# Altium schematic sheet microcontroller.SchDoc: Microcontroller
size A4; DrawnBy: Schuszter André
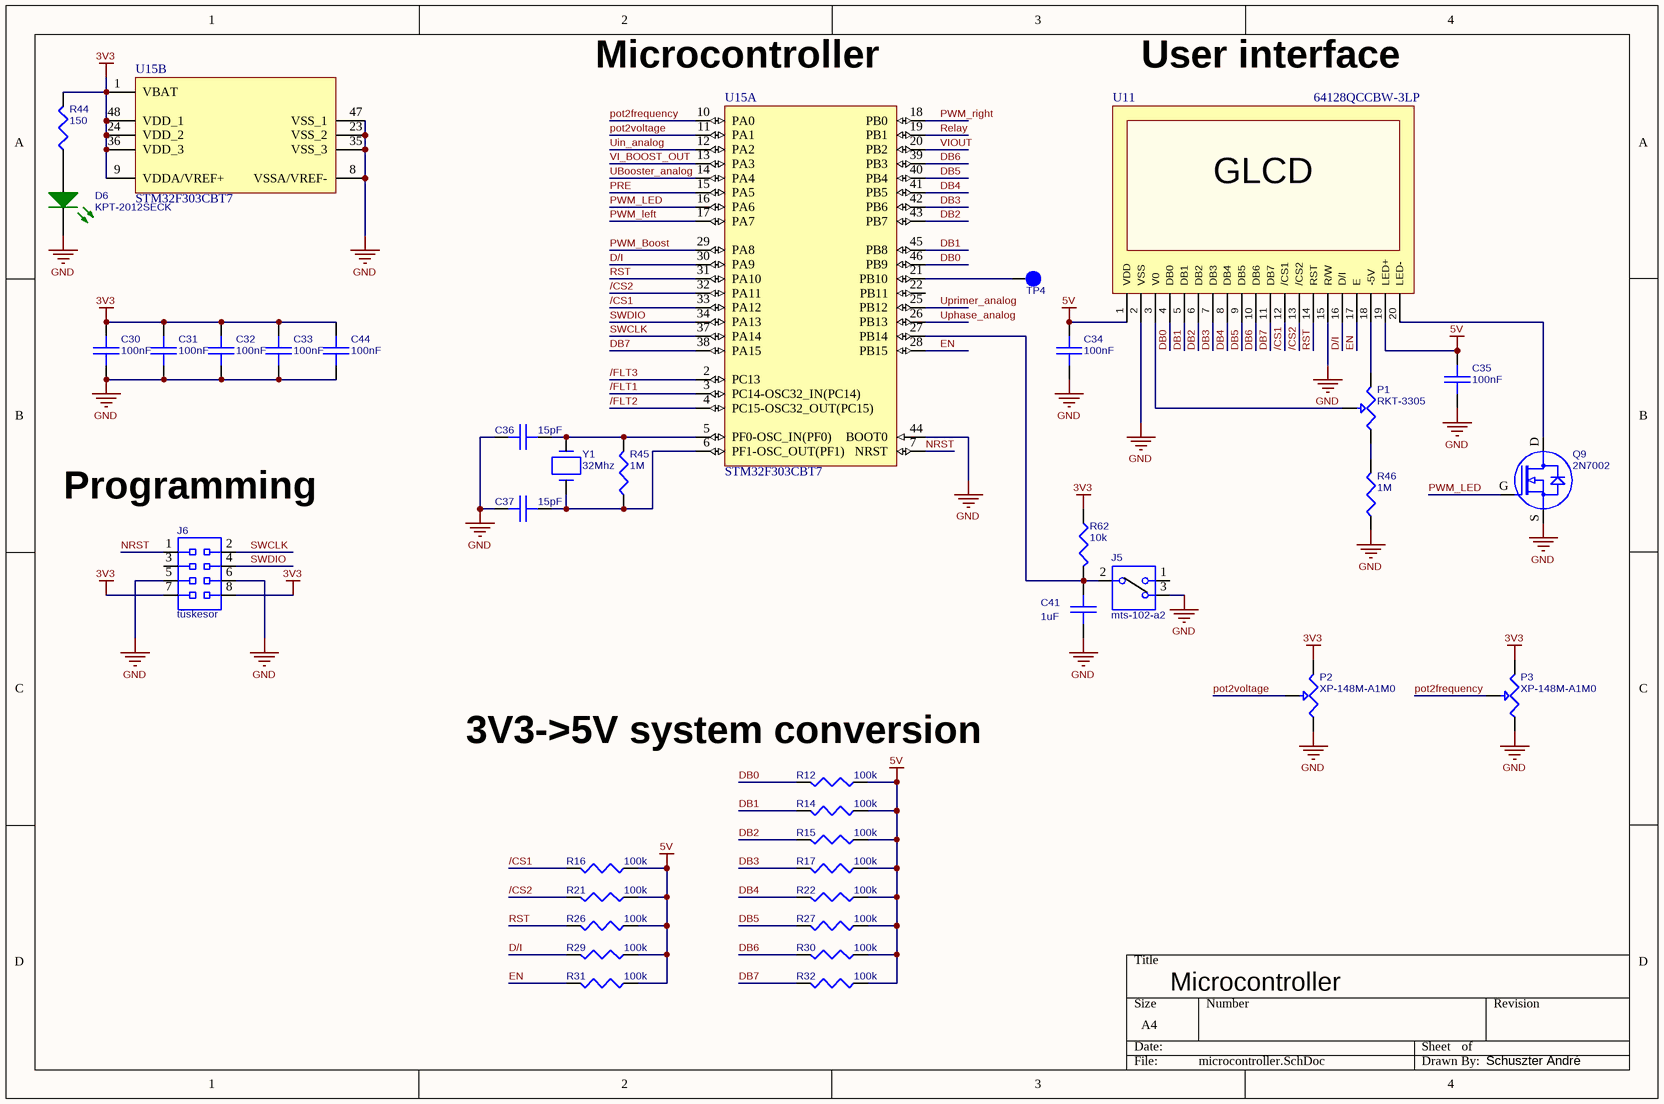
[diagram p0: microcontroller.SchDoc]

## Parts
C30  100nF  [CAPC2012X06N]
C31  100nF  [CAPC2012X06N]
C32  100nF  [CAPC2012X06N]
C33  100nF  [CAPC2012X06N]
C34  100nF  [CAPC2012X06N]
C35  100nF  [CAPC2012X06N]
C36  15pF  [CAPC2012X06N]
C37  15pF  [CAPC2012X06N]
C41  1uF  [CAPC2012X06N]
C44  100nF  [CAPC2012X06N]
D6  KPT-2012SECK  [LED2012X11N_GREEN]
J5  mts-102-a2  [TOGGLE]
J6  tüskesor  [PINH_M_2X4_100MIL_TH_HARWIN]
P1  RKT-3305  [TRIMMER]
P2  XP-148M-A1M0  [potmeter]
P3  XP-148M-A1M0  [potmeter]
Q9  2N7002  [SOT95P240X111_SGD-3N]
R12  100k  [RESC2012X06N]
R14  100k  [RESC2012X06N]
R15  100k  [RESC2012X06N]
R16  100k  [RESC2012X06N]
R17  100k  [RESC2012X06N]
R21  100k  [RESC2012X06N]
R22  100k  [RESC2012X06N]
R26  100k  [RESC2012X06N]
R27  100k  [RESC2012X06N]
R29  100k  [RESC2012X06N]
R30  100k  [RESC2012X06N]
R31  100k  [RESC2012X06N]
R32  100k  [RESC2012X06N]
R44  150  [RESC2012X06N]
R45  1M  [RESC2012X06N]
R46  1M  [RESC2012X06N]
R62  10k  [RESC2012X06N]
TP4  Comment  [TP200X150]  (value not drawn)  (no BOM)
U11  64128QCCBW-3LP  [LCD]
U15  STM32F303CBT7  [STM-LQFP48_N]  (parts A,B of 2)
Y1  32Mhz  [XTAL]

## Nets
3V3: C30.1 C31.1 C32.1 C33.1 C44.1 J6.7 J6.8 P2.3 P3.3 R44.2 R62.2 U15.1(VBAT) U15.9(VDDA/VREF+) U15.24(VDD_2) U15.36(VDD_3) U15.48(VDD_1)
5V: C34.1 C35.1 R12.1 R14.1 R15.1 R16.1 R17.1 R21.1 R22.1 R26.1 R27.1 R29.1 R30.1 R31.1 R32.1 U11.1(VDD) U11.19(LED+)
GND: C30.2 C31.2 C32.2 C33.2 C34.2 C35.2 C36.1 C37.1 C41.2 C44.2 D6.C J5.3 J6.5 J6.6 P2.1 P3.1 Q9.S R46.1 U11.2(VSS) U11.15(R/W) U15.8(VSSA/VREF-) U15.23(VSS_2) U15.35(VSS_3) U15.44(BOOT0) U15.47(VSS_1)
/CS1: R16.2 U11.12(/CS1) U15.33(PA12)
/CS2: R21.2 U11.13(/CS2) U15.32(PA11)
/FLT1: U15.3(PC14-OSC32_IN(PC14))
/FLT2: U15.4(PC15-OSC32_OUT(PC15))
/FLT3: U15.2(PC13)
D/I: R29.2 U11.16(D/I) U15.30(PA9)
DB0: R12.2 U11.4(DB0) U15.46(PB9)
DB1: R14.2 U11.5(DB1) U15.45(PB8)
DB2: R15.2 U11.6(DB2) U15.43(PB7)
DB3: R17.2 U11.7(DB3) U15.42(PB6)
DB4: R22.2 U11.8(DB4) U15.41(PB5)
DB5: R27.2 U11.9(DB5) U15.40(PB4)
DB6: R30.2 U11.10(DB6) U15.39(PB3)
DB7: R32.2 U11.11(DB7) U15.38(PA15)
EN: R31.2 U11.17(E) U15.28(PB15)
NRST: J6.1 U15.7(NRST)
pot2frequency: P3.2 U15.10(PA0)
pot2voltage: P2.2 U15.11(PA1)
PRE: U15.15(PA5)
PWM_Boost: U15.29(PA8)
PWM_LED: Q9.G U15.16(PA6)
PWM_left: U15.17(PA7)
PWM_right: U15.18(PB0)
Relay: U15.19(PB1)
RST: R26.2 U11.14(RST) U15.31(PA10)
SWCLK: J6.2 U15.37(PA14)
SWDIO: J6.4 U15.34(PA13)
UBooster_analog: U15.14(PA4)
Uin_analog: U15.12(PA2)
Uphase_analog: U15.26(PB13)
Uprimer_analog: U15.25(PB12)
VI_BOOST_OUT: U15.13(PA3)
VIOUT: U15.20(PB2)
NetC36_2: C36.2 R45.2 U15.5(PF0-OSC_IN(PF0)) Y1.2
NetC37_2: C37.2 R45.1 U15.6(PF1-OSC_OUT(PF1)) Y1.1
NetC41_1: C41.1 J5.2 R62.1 U15.27(PB14)
NetD6_A: D6.A R44.1
NetP1_1: P1.1 R46.2
NetP1_2: P1.2 U11.3(V0)
NetP1_3: P1.3 U11.18(-5V)
NetQ9_D: Q9.D U11.20(LED-)
NetTP4_1: TP4.1(Pin1) U15.21(PB10)

Not connected (* = marked no-connect by the designer): J5 1; J6 3; U15 22(PB11)

## Notes on the sheet
- (near U15) Microcontroller
- User interface
- (near J6) Programming
- (near R12) 3V3->5V system conversion
- (in symbol LCD) GLCD

## Library data of the parts
C30-C35 C44 = CAPC: 82-07-32
C36 C37 = CAPC: 82-00-94
C41 = CAPC: 2495497
D6 = LED_GREEN: 2099237; Code: 2099237; Part number: KPT-2012SECK; Supplier: Farnell
J5 = TOGGLE_SPDT: 45-08-76; Part number: TOGGLE D= 6 3P SPDT MTS-102-A2 (FEM) ON-ON 6A 125VAC 1AK.2ALL.PCB; Supplier: Lomex; Code: 45-08-76
J6 = CON_2X4
P1 = TRIMMER: 90-00-58; Supplier: Lomex; Code: 90-00-58; Part number: RKT-3305
P2 P3 = Potmeter: 06-03-80; Supplier: Lomex; Code: 06-03-80; Part number: XP-148M-A1M0
Q9 = RELÉ_NFET: 86-00-97; Part number: 2N7002 (NXP) N-FET 60V 0.3A 0.83W Rds>5R SOT-23 ˝12W˝ (SN7002); Supplier: Lomex; Code: 86-00-97
R12 R14-R17 R21 R22 R26 R27 R29-R32 = RES_US_HOR: 81-11-11
R44 = RES_US_HOR: 81-10-77
R45 R46 = RES_US_HOR: 81-11-22
R62 = RES_US_HOR: 80-10-98
TP4 = TP_SMD
U11 = LCD: Supplier: Lomex; Code: 37-00-71; Part number: 64128QCCBW-3LP
U15 = STM32F303CBT7: ARM Cortex-M4 32-bit MCU, 128 KB Flash, 32 KB Internal RAM, 37 I/Os, 48-pin LQFP, -40 to 105 degC, Tray; D/A Converter: 2x12-bit (2 Channel); FLASH Size (Prog) (kB): 128; I/Os (High Current): 37; Internal RAM Size (kB): 32; Operating Frequency(F) (Processor speed) (MHz): 72; Supply Voltage(Vcc) min (V): 2; DatasheetVersion: Rev. 6; PackageVersion: Rev. 6, 06/2013; PackageReference: LQFP48; PackageDescription: 48-Pin Low Profile Quad Flat Package, 7 x 7 mm Body, 0.5 mm Pitch; Supplier 1: Farnell; Supplier Part Number 1: 2333361; Supplier 2: Newark; Supplier Part Number 2: 99W9872; Supplier 3: Mouser; Supplier Part Number 3: N/A; Core: ARM Cortex-M4; Packing: Tray; Mounting Technology: Surface Mount; PartNumber: STM32F303CBT7; ComponentLink1Description: Manufacturer URL; ComponentLink1URL: http://www.st.com/web/en/home.html; ComponentLink2Description: Datasheet; ComponentLink2URL: http://www.st.com/st-web-ui/static/active/en/resource/technical/document/datasheet/DM00058181.pdf; ComponentLink3Description: Package Specification; ComponentLink3URL: http://www.st.com/st-web-ui/static/active/en/resource/technical/document/datasheet/DM00058181.pdf
Y1 = XTAL: 40-01-35; Part number: QUARZ HC49/S (NSK) 30ppm 20pF LOW PROFILE; Supplier: Lomex; code: 40-01-35